# Altium project DistribValveBoard.PrjPCB
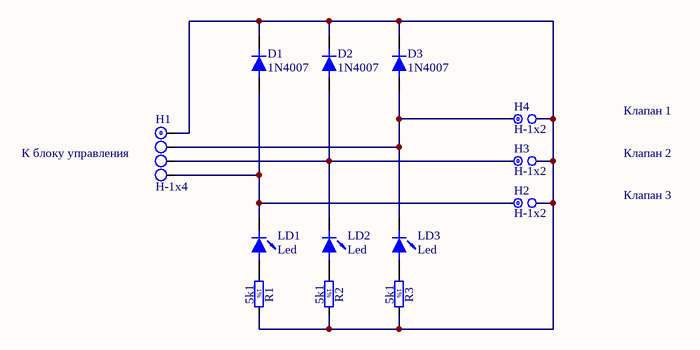
[diagram p0: DistrValveBrd.SchDoc]
1 sheet, 13 parts. Net scope: global (net labels, ports and power ports of the same name join across sheets).
Board file: DistribValveBrd.PcbDoc

## Sheet DistrValveBrd.SchDoc
size A4

### Parts
D1  1N4007  [DO-41-300]
D2  1N4007  [DO-41-300]
D3  1N4007  [DO-41-300]
H1  H-1x4  [J1x4]
H2  H-1x2  [J1x2]
H3  H-1x2  [J1x2]
H4  H-1x2  [J1x2]
LD1  Led  [Led d5mm]
LD2  Led  [Led d5mm]
LD3  Led  [Led d5mm]
R1  5k1  [RESC2012X60N]
R2  5k1  [RESC2012X60N]
R3  5k1  [RESC2012X60N]

### Nets
NetD1_1: D1.1(A) H1.4 H2.1 LD1.2(K)
NetD1_2: D1.2(K) D2.2(K) D3.2(K) H1.1 H2.2 H3.2 H4.2 R1.2 R2.2 R3.2
NetD2_1: D2.1(A) H1.3 H3.1 LD2.2(K)
NetD3_1: D3.1(A) H1.2 H4.1 LD3.2(K)
NetLD1_1: LD1.1(A) R1.1
NetLD2_1: LD2.1(A) R2.1
NetLD3_1: LD3.1(A) R3.1

### Notes on the sheet
- Клапан 1
- (near H1) К блоку управления
- Клапан 2
- Клапан 3
- (in symbol R0805_5K1_1%_0.125W_100PPM) 1%

### Library data of the parts
D1-D3 = 1N4007: 1000V 1A; Price: 0.05
LD1-LD3 = Led-5mm: 5mm; Price: 0.05
R1-R3 = R0805_5K1_1%_0.125W_100PPM: Resistor - 1%; Part Description: General Purpose Thick Film Chip Resistor; Manufacturer: GENERIC; Manufacturer1 Part Number: NRC10F5101TRF; Power: 0.125W; TC: ±100ppm/°C; Table: Resistors SMD; Part Number: R0805_5K1_1%_0.125W_100PPM; Component Kind: Standard; Component Type: Standard; Pin Count: 2; Value: 5k1; Status: Preferred; Tolerance: ±1%; Manufacturer Part Number: R0805_5K1_1%_0.125W_100PPM; Case: 0805; Mounted: Yes; Socket: No; SMD: Yes; Manufacturer1 Example: NIC COMPONENT; Manufacturer1 ComponentHeight: 0.6mm; HelpURL: \\cern.ch\dfs\Applications\Altium\Datasheets\R0805_NIC_NRC.pdf; Author: CERN DEM JLC; CreateDate: 03.12.2007; LatestRevisionDate: 13.03.2008
H1 = H-1x4: Price: 0.04
H2-H4 = H-1x2: Price: 0.02